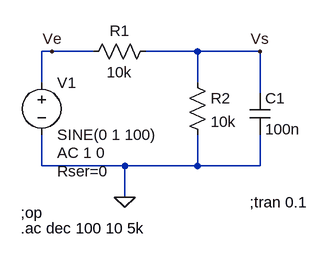
[diagram p0: schematic divTension.asc]
divTension.asc, the LTspice schematic file:
Version 4
SHEET 1 880 680
WIRE -400 352 -416 352
WIRE -336 352 -400 352
WIRE -176 352 -256 352
WIRE -80 352 -176 352
WIRE -416 400 -416 352
WIRE -176 400 -176 352
WIRE -80 416 -80 352
WIRE -416 528 -416 480
WIRE -288 528 -416 528
WIRE -176 528 -176 480
WIRE -176 528 -288 528
WIRE -80 528 -80 480
WIRE -80 528 -176 528
WIRE -288 576 -288 528
FLAG -288 576 0
FLAG -400 352 Ve
FLAG -80 352 Vs
SYMBOL voltage -416 384 R0
WINDOW 123 24 124 Left 2
WINDOW 39 24 152 Left 2
SYMATTR Value2 AC 1 0
SYMATTR SpiceLine Rser=0
SYMATTR InstName V1
SYMATTR Value SINE(0 1 100)
SYMBOL res -240 336 R90
WINDOW 0 0 56 VBottom 2
WINDOW 3 32 56 VTop 2
SYMATTR InstName R1
SYMATTR Value 10k
SYMBOL res -192 384 R0
SYMATTR InstName R2
SYMATTR Value 10k
SYMBOL cap -96 416 R0
SYMATTR InstName C1
SYMATTR Value 100n
TEXT -448 600 Left 2 !;op
TEXT -448 624 Left 2 !.ac dec 100 10 5k
TEXT -96 584 Left 2 !;tran 0.1

The netlist it stands for:
* divTension.asc
V1 Ve 0 SINE(0 1 100) AC 1 0 Rser=0
R1 Vs Ve 10k
R2 Vs 0 10k
C1 Vs 0 100n
;op
.ac dec 100 10 5k
;tran 0.1
.backanno
.end

* Results of the author's LTspice run, read from the files saved beside the schematic
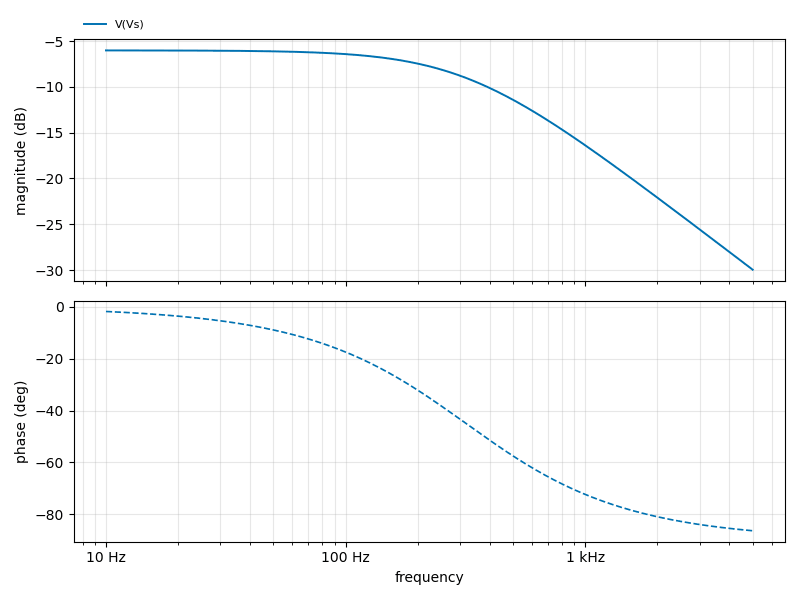
[diagram p1: AC Analysis of divTension.asc, plotted from the saved traces]
* AC Analysis, 1 run:
*   V(Vs): -6.02 dB at 10 Hz, -29.96 dB at 5 kHz, peak -6.02 dB at 10 Hz, 3 dB below the peak at 318.6 Hz